# EasyEDA Pro project Echo EasyEDA professional project.epro, schematic Schematic1
Create Date: 2024-12-16; Page Name: P1; Project Name: Bynraky_pcb; Schematic Name: Schematic1; Update Date: 2025-02-06; Company: EasyEDA.com; Drawn: EasyEDA; Page Size: A4; Part Number: JLCPCB-002; Reviewed: EasyEDA; Version: V0.1
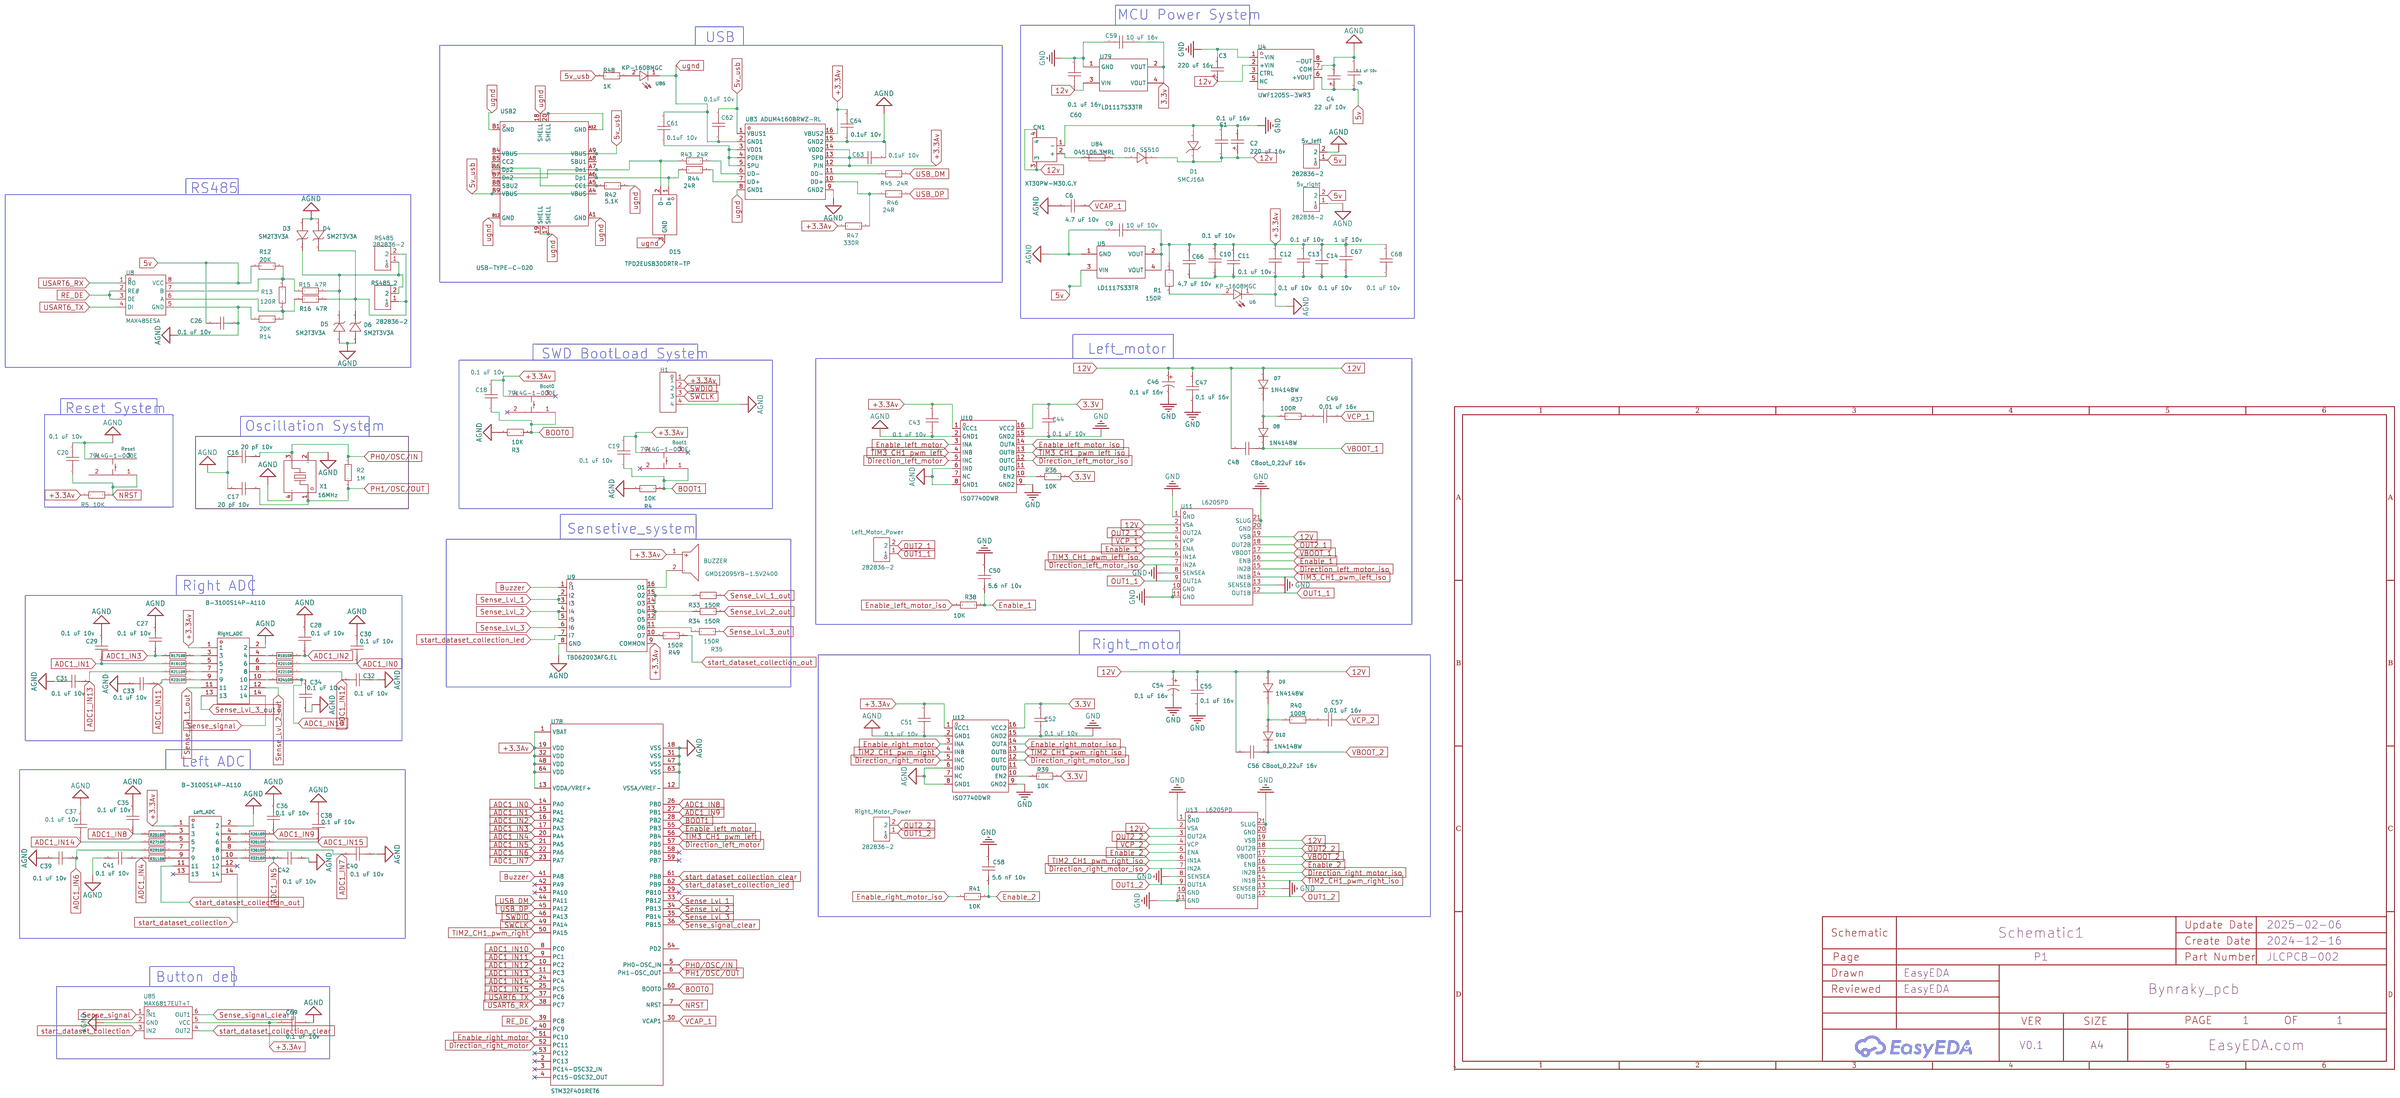
[diagram p0: schematic sheet]

## Parts
5v_left  282836-2  [CONN-TH_2P-P5.00_282836-2]
5v_right  282836-2  [CONN-TH_2P-P5.00_282836-2]
Boot0  7914G-1-000E  [KEY-SMD_4P-L5.0-W5.0-P2.54-LS5.5-BL]
Boot1  7914G-1-000E  [KEY-SMD_4P-L5.0-W5.0-P2.54-LS5.5-BL]
BUZZER  GMD12095YB-1.5V2400  [BUZ-TH_BD12.0-P7.60-D0.6-FD]
C1  0.1 uF 16v  [C0603]
C2  220 uF 16v  [CASE-E_7343]
C3  220 uF 16v  [CASE-E_7343]
C4  22 uF 10v  [CASE-B_3528]
C5  0.1 uF 10v  [C0603]
C6  4.7 uF 10v  [C0603]
C9  10 uF 10v  [C0603]
C10  0.1 uF 10v  [C0603]
C11  0.1 uF 10v  [C0603]
C12  0.1 uF 10v  [C0603]
C13  0.1 uF 10v  [C0603]
C14  0.1 uF 10v  [C0603]
C16  20 pF 10v  [C0603]
C17  20 pF 10v  [C0603]
C18  0.1 uF 10v  [C0603]
C19  0.1 uF 10v  [C0603]
C20  0.1 uF 10v  [C0603]
C26  0.1 uF 10v  [C0603]
C27  0.1 uF 10v  [C0603]
C28  0.1 uF 10v  [C0603]
C29  0.1 uF 10v  [C0603]
C30  0.1 uF 10v  [C0603]
C31  0.1 uF 10v  [C0603]
C32  0.1 uF 10v  [C0603]
C33  0.1 uF 10v  [C0603]
C34  0.1 uF 10v  [C0603]
C35  0.1 uF 10v  [C0603]
C36  0.1 uF 10v  [C0603]
C37  0.1 uF 10v  [C0603]
C38  0.1 uF 10v  [C0603]
C39  0.1 uF 10v  [C0603]
C40  0.1 uF 10v  [C0603]
C41  0.1 uF 10v  [C0603]
C42  0.1 uF 10v  [C0603]
C43  0.1 uF 10v  [C0603]
C44  0.1 uF 10v  [C0603]
C46  0,1 uF 16v  [CASE-A_3216]
C47  0,1 uF 16v  [C0603]
C48  CBoot_0,22uF 16v  [C0603]
C49  0,01 uF 16v  [C0603]
C50  5.6 nF 10v  [C0603]
C51  0.1 uF 10v  [C0603]
C52  0.1 uF 10v  [C0603]
C54  0,1 uF 16v  [CASE-A_3216]
C55  0,1 uF 16v  [C0603]
C56  CBoot_0,22uF 16v  [C0603]
C57  0,01 uF 16v  [C0603]
C58  5.6 nF 10v  [C0603]
C59  10 uF 16v  [C0603]
C60  0.1 uF 16v  [C0603]
C61  0.1uF 10v  [C0603]
C62  0.1uF 10v  [C0603]
C63  0.1uF 10v  [C0603]
C64  0.1uF 10v  [C0603]
C66  4.7 uF 10v  [C0603]
C67  1 uF 10v  [C0603]
C68  0.1 uF 10v  [C0603]
C69  0.1 uF 10v  [C0603]
CN1  XT30PW-M30.G.Y  [CONN-TH_XT30PW-M]
D1  SMCJ16A  [SMC_L6.9-W5.9-LS7.9-RD]
D3  SM2T3V3A  [DO-216AA_L1.9-W1.9-LS3.8-FD]
D4  SM2T3V3A  [DO-216AA_L1.9-W1.9-LS3.8-FD]
D5  SM2T3V3A  [DO-216AA_L1.9-W1.9-LS3.8-FD]
D6  SM2T3V3A  [DO-216AA_L1.9-W1.9-LS3.8-FD]
D7  1N4148W  [SOD-123FL_L2.7-W1.6-LS3.8-RD]
D8  1N4148W  [SOD-123FL_L2.7-W1.6-LS3.8-RD]
D9  1N4148W  [SOD-123FL_L2.7-W1.6-LS3.8-RD]
D10  1N4148W  [SOD-123FL_L2.7-W1.6-LS3.8-RD]
D15  TPD2EUSB30DRTR-TP  [SOT-723-3_L1.2-W0.8-LS1.20-BR]
D16  SS510  [SMA_L4.4-W2.8-LS5.4-RD]
H1  -  [HDR-TH_4P-P2.54-V-M]
Left_ADC  B-3100S14P-A110  [IDC-TH_310S-14P]
Left_Motor_Power  282836-2  [CONN-TH_2P-P5.00_282836-2]
R1  150R  [R0805]
R2  1M  [R0603]
R3  10K  [R0603]
R4  10K  [R0603]
R5  10K  [R0603]
R12  20K  [R0603]
R13  120R  [R1206]
R14  20K  [R0603]
R15  47R  [R0603]
R16  47R  [R0603]
R17  10R  [R0603]
R18  10R  [R0603]
R19  10R  [R0603]
R20  10R  [R0603]
R21  10R  [R0603]
R22  10R  [R0603]
R23  10R  [R0603]
R24  10R  [R0603]
R25  10R  [R0603]
R26  10R  [R0603]
R27  10R  [R0603]
R28  10R  [R0603]
R29  10R  [R0603]
R30  10R  [R0603]
R31  10R  [R0603]
R32  10R  [R0603]
R33  150R  [R0603]
R34  150R  [R0603]
R35  150R  [R0603]
R36  10K  [R0603]
R37  100R  [R0603]
R38  10K  [R0603]
R39  10K  [R0603]
R40  100R  [R0603]
R41  10K  [R0603]
R42  5,1K  [R0603]
R43  24R  [R0603]
R44  24R  [R0603]
R45  24R  [R0603]
R46  24R  [R0603]
R47  330R  [R0603]
R48  1K  [R0603]
R49  150R  [R0603]
Reset  7914G-1-000E  [KEY-SMD_4P-L5.0-W5.0-P2.54-LS5.5-BL]
Right_ADC  B-3100S14P-A110  [IDC-TH_310S-14P]
Right_Motor_Power  282836-2  [CONN-TH_2P-P5.00_282836-2]
RS485  282836-2  [CONN-TH_2P-P5.00_282836-2]
RS485_2  282836-2  [CONN-TH_2P-P5.00_282836-2]
U4  UWF1205S-3WR3  [PWRM-TH_UWFXXXXS-3WR3]
U5  LD1117S33TR  [SOT-223_L6.5-W3.5-P2.30-LS7.0-BR]
U6  KP-1608MGC  [LED0603-RD_GREEN]
U8  MAX485ESA  [SOIC-8_L4.9-W3.9-P1.27-LS6.0-BL]
U9  TBD62003AFG,EL  [SOP-16_L10.0-W4.4-P1.27-LS6.3-BL]
U10  ISO7740DWR  [SOIC-16_L10.3-W7.5-P1.27-LS10.3-BL]
U11  L6205PD  [POWERSO20_L15.9-W11.0-P1.27-LS14.2-BL-EP]
U12  ISO7740DWR  [SOIC-16_L10.3-W7.5-P1.27-LS10.3-BL]
U13  L6205PD  [POWERSO20_L15.9-W11.0-P1.27-LS14.2-BL-EP]
U78  STM32F401RET6  [LQFP-64_L10.0-W10.0-P0.50-LS12.0-BL]
U79  LD1117S33TR  [SOT-223_L6.5-W3.5-P2.30-LS7.0-BR]
U83  ADUM4160BRWZ-RL  [SOIC-16_L10.3-W7.5-P1.27-LS10.3-BL]
U84  045106.3MRL  [FUSE-SMD_L6.1-W2.6]
U85  MAX6817EUT+T  [SOT-23-6_L2.9-W1.6-P0.95-LS2.8-BL]
U86  KP-1608MGC  [LED0603-RD_GREEN]
USB2  USB-TYPE-C-020  [USB-SMD_USB-TYPE-C-020]
X1  16MHz  [CRYSTAL-SMD_4P-L5.0-W3.2-BL]

## Library data of the parts
5v_left 5v_right Left_Motor_Power Right_Motor_Power RS485 RS485_2 = 282836-2: Pitch:5mm Color:Green Mounting Style:Direct Insert Current Rating (Max):13.5A Voltage Rating (Max):300V Number of Pins:2P Number of Rows:1 Wire Gauge - AWG:16~30 Wire Gauge - AWG:16~30 Number of PINs Per Row:2; LCSC Part Name: 5mm 排数:1 每排P数:2 直插; Supplier Part: C590402; Manufacturer: TE Connectivity(泰科电子); Supplier Footprint: 插件,P=5mm; JLCPCB Part Class: Extended Part; Datasheet: https://atta.szlcsc.com/upload/public/pdf/source/20240119/1DE6D9456CCE01F1F664469E3029A1B4.pdf; Supplier: LCSC; Pitch: 5mm; Color: Green; Mounting Style: Direct Insert; Current Rating (Max): 13.5A; Voltage Rating (Max): 300V; Number of Pins: 2P; Number of Rows: 1; Wire Gauge - AWG: 16~30; Number of PINs Per Row: 2
Boot0 Boot1 Reset = 7914G-1-000E: Circuit:SPST-常开 Actuator Style:Round Button Operating Force:300gf Mounting Style:Brick nogging Contact Current:100mA Voltage Rating (DC):16V IP Rating:IP67 Pin Style:Gull Wing Operating Temperature:-55℃~+125℃ Operating Temperature:-55℃~+125℃; Supplier Part: C840653; Manufacturer: BOURNS; JLCPCB Part Class: Extended Part; Supplier: LCSC; Circuit: SPST-常开; Actuator Style: Round Button; Operating Force: 300gf; Mounting Style: Brick nogging; Contact Current: 100mA; Voltage Rating (DC): 16V; IP Rating: IP67; Pin Style: Gull Wing; Operating Temperature: -55℃~+125℃
BUZZER = GMD12095YB-1.5V2400: Supplier Part: C530406; Manufacturer: INGHAi(赢海); JLCPCB Part Class: Extended Part; Datasheet: https://atta.szlcsc.com/upload/public/pdf/source/20200702/C530406_E9C45F62392D9607487F1F351BFF23F3.pdf; Supplier: LCSC
C1 C5 C6 C9-C14 C16-C20 C26-C44 C47-C52 C55-C64 C66-C69 = CAP_0603: Supplier Footprint: 0603
C2 C3 = TAJE227K016RNJ: Capacitance: Tolerance:±10% Tolerance:±10% Rated Voltage: Equivalent Series Resistance(ESR):500mΩ@100kHz Operating Temperature:-55℃~+125℃ Operating Temperature:-55℃~+125℃; LCSC Part Name: 220uF ±10% 16V; Supplier Part: C7231; Manufacturer: Kyocera AVX; Supplier Footprint: CASE-E-7343; JLCPCB Part Class: Extended Part; Datasheet: https://atta.szlcsc.com/upload/public/pdf/source/20160107/1457707750344.pdf; Supplier: LCSC; Tolerance: ±10%; Equivalent Series Resistance(ESR): 500mΩ@100kHz; Operating Temperature: -55℃~+125℃
C4 = TAJB226K016RNJ: Capacitance: Tolerance:±10% Tolerance:±10% Rated Voltage: Equivalent Series Resistance(ESR):2.3Ω@100kHz Operating Temperature:-55℃~+125℃ Operating Temperature:-55℃~+125℃; LCSC Part Name: 22uF ±10% 16V; Supplier Part: C8020; Manufacturer: Kyocera AVX; Supplier Footprint: CASE-B-3528; JLCPCB Part Class: Extended Part; Datasheet: https://atta.szlcsc.com/upload/public/pdf/source/20160107/1457707750344.pdf; Supplier: LCSC; Tolerance: ±10%; Equivalent Series Resistance(ESR): 2.3Ω@100kHz; Operating Temperature: -55℃~+125℃
C46 C54 = CA45-A016K106T: Capacitance: Tolerance:±10% Tolerance:±10% Rated Voltage: Equivalent Series Resistance(ESR):3Ω@100kHz Operating Temperature:-55℃~+125℃ Operating Temperature:-55℃~+125℃; LCSC Part Name: 10uF ±10% 16V; Supplier Part: C119051; Manufacturer: 湘怡中元/湘江; Supplier Footprint: CASE-A-3216; JLCPCB Part Class: Extended Part; Datasheet: https://atta.szlcsc.com/upload/public/pdf/source/20191009/C435293_78A410F3D73489DBEAC46056C4262F7A.pdf; Supplier: LCSC; Tolerance: ±10%; Equivalent Series Resistance(ESR): 3Ω@100kHz; Operating Temperature: -55℃~+125℃
CN1 = XT30PW-M30.G.Y: Power:- Output:- Input:- Size:- Interface:- Type:- Colour:- MaximumCurrent:- Type:Aviation model plug RatedVoltage:DC 500V Type1:- NumberOfUSBHoles:- InterfaceType:Male head MetalMaterial:- InsulationMaterial:- RatedCurrent:15A RecommendedWireGauge:16/18/; LCSC Part Name: AMASS(艾迈斯)航模插头 卧式弯脚 XT30PW-M公头; Supplier Part: C431092; Manufacturer: AMASS(艾迈斯); JLCPCB Part Class: Extended Part; Datasheet: https://atta.szlcsc.com/upload/public/pdf/source/20220222/6A9F22F7850E25B33E1BE430ADF8560B.pdf; Supplier: LCSC; Type: Aviation model plug; RatedVoltage: DC 500V; InterfaceType: Male head; RatedCurrent: 15A; RecommendedWireGauge: 16/18/20AWG; contact resistance: 1.2mΩ; specifications: 2pin
D1 = SMCJ16A_C310019: Reverse Stand-Off Voltage (Vrwm):16V Maximum Clamping Voltage:26V Peak Pulse Current (Ipp)@10/1000us:57.7A Breakdown Voltage:17.8V Type:TVS; Supplier Part: C310019; Manufacturer: Brightking(君耀电子); Supplier Footprint: SMC(DO-214AB); JLCPCB Part Class: Extended Part; Datasheet: https://atta.szlcsc.com/upload/public/pdf/source/20181127/C310089_DF11A7ED4CCF9CC3586EB1D10F86E9D6.pdf; Supplier: LCSC; Reverse Stand-Off Voltage (Vrwm): 16V; Maximum Clamping Voltage: 26V; Peak Pulse Current (Ipp)@10/1000us: 57.7A; Breakdown Voltage: 17.8V; Type: TVS
D3-D6 = SM2T3V3A: Reverse Stand-Off Voltage (Vrwm):3.3V Maximum Clamping Voltage:6.8V Peak Pulse Current (Ipp)@10/1000us:25A Peak Pulse Power Dissipation (Ppp)@10/1000us:200W Breakdown Voltage:3.6V Reverse Leakage Current (Ir):500uA Type:TVS; LCSC Part Name: 单向TVS 3.3V截止 25A峰值脉冲; Supplier Part: C970557; Manufacturer: ST(意法半导体); Supplier Footprint: DO-216AA; JLCPCB Part Class: Extended Part; Datasheet: https://atta.szlcsc.com/upload/public/pdf/source/20201211/C970557_EBE10214B1FDEDE84815AE73A3ED0A7F.pdf; Supplier: LCSC; Reverse Stand-Off Voltage (Vrwm): 3.3V; Maximum Clamping Voltage: 6.8V; Peak Pulse Current (Ipp)@10/1000us: 25A; Peak Pulse Power Dissipation (Ppp)@10/1000us: 200W; Breakdown Voltage: 3.6V; Reverse Leakage Current (Ir): 500uA; Type: TVS
D7-D10 = 1N4148W_C143180: Diode Configuration: Forward Voltage (Vf@If):1.25V@150mA Reverse Voltage (Vr): Average Rectified Current (Io): Power Dissipation: Reverse Leakage Current:2.5uA@75V Reverse Recovery Time (trr): Operating Temperature:-55℃~+150℃@(Tj) Operating Temperature:-5; LCSC Part Name: 电压:75V 电流:150mA; Supplier Part: C143180; Manufacturer: FMS(美丽微); Supplier Footprint: SOD-123; JLCPCB Part Class: Extended Part; Datasheet: https://atta.szlcsc.com/upload/public/pdf/source/20171109/C143180_15102201600451103731.pdf; Supplier: LCSC; Forward Voltage (Vf@If): 1.25V@150mA; Reverse Leakage Current: 2.5uA@75V; Operating Temperature: -55℃~+150℃@(Tj)
D15 = TPD2EUSB30DRTR-TP: Supplier Part: C2844720; Manufacturer: TECH PUBLIC(台舟); Supplier Footprint: SOT-723-3; JLCPCB Part Class: Extended Part; Datasheet: https://atta.szlcsc.com/upload/public/pdf/source/20210910/0ECB21791D44DF637915A47DDFBF4563.pdf; Supplier: LCSC
D16 = SS510_C106905: Forward Voltage (Vf@If):850mV@5A Reverse Voltage (Vr):100V Average Rectified Current (Io):5A Reverse Leakage Current (Ir):50uA@100V; LCSC Part Name: 电压:100V 电流:5A; Supplier Part: C106905; Manufacturer: DIYI(迪一/芯诺); Supplier Footprint: SMA(DO-214AC); JLCPCB Part Class: Extended Part; Datasheet: https://atta.szlcsc.com/upload/public/pdf/source/20170413/1492062743215.pdf; Supplier: LCSC; Forward Voltage (Vf@If): 850mV@5A; Reverse Voltage (Vr): 100V; Average Rectified Current (Io): 5A; Reverse Leakage Current (Ir): 50uA@100V
H1 = HDR-M_2.54_1x4P: Supplier Footprint: Through
Left_ADC Right_ADC = B-3100S14P-A110: Connector Type:Horn buckle Pitch:2.54mm Structure:2x7P Holder Type:Straight Row Spacing:2.54mm Number of Rows:2 Pin Number in each Row:7 Contact Material:Brass Contact Plating:Gold; LCSC Part Name: 2.54mm 2x7P 排数:2 每排P数:7; Supplier Part: C146651; Manufacturer: Ckmtw(灿科盟); Supplier Footprint: 插件,P=2.54mm; JLCPCB Part Class: Extended Part; Datasheet: https://atta.szlcsc.com/upload/public/pdf/source/20171116/C146660_15108222388271123939.pdf; Supplier: LCSC; Connector Type: Horn buckle; Pitch: 2.54mm; Structure: 2x7P; Holder Type: Straight; Row Spacing: 2.54mm; Number of Rows: 2; Pin Number in each Row: 7; Contact Material: Brass; Contact Plating: Gold
R1 = ERJ6ENF2053V: Type:Thick Film Resistors Resistance:205kΩ Tolerance:±1% Tolerance:±1% Power(Watts): Overload Voltage (Max):- Temperature Coefficient:±100ppm/℃ Temperature Coefficient:±100ppm/℃ Operating Temperature Range:-55℃~+155℃ Operating Temperature Range:-55℃~+155℃; LCSC Part Name: 205kΩ ±1% 125mW 厚膜电阻; Supplier Part: C2077507; Manufacturer: PANASONIC(松下); Supplier Footprint: 0805; JLCPCB Part Class: Extended Part; Datasheet: https://atta.szlcsc.com/upload/public/pdf/source/20240116/DC5257A3024E44D37E518C2D5EB5F78B.pdf; Supplier: LCSC; Type: Thick Film Resistors; Tolerance: ±1%; Temperature Coefficient: ±100ppm/℃; Operating Temperature Range: -55℃~+155℃
R2-R5 R12 R14-R49 = Res_0603: Supplier Footprint: 0603
R13 = 1206W4J0121T5E: Type:Thick Film Resistors Resistance: Tolerance:±5% Tolerance:±5% Power(Watts): Overload Voltage (Max): Temperature Coefficient:±100ppm/℃ Temperature Coefficient:±100ppm/℃ Operating Temperature Range:-55℃~+155℃ Operating Temperature Range:-55℃~+155℃; LCSC Part Name: 120Ω ±5% 250mW 厚膜电阻; Supplier Part: C25351; Manufacturer: UNI-ROYAL(厚声); Supplier Footprint: 1206; JLCPCB Part Class: Extended Part; Datasheet: https://atta.szlcsc.com/upload/public/pdf/source/20200306/C422600_1E6D84923E4A46A82E41ADD87F860B5C.pdf; Supplier: LCSC; Type: Thick Film Resistors; Tolerance: ±5%; Temperature Coefficient: ±100ppm/℃; Operating Temperature Range: -55℃~+155℃
U4 = UWF1205S-3WR3_C41355411: TYPE:Boost type Number of channel:1 Power:6W input voltage (Vdc):4.5V~36V input voltage (Vdc):4.5V~36V Conversion Efficiency:78% Conversion Efficiency:78% Output Voltage:5V Output Voltage:5V Output Current (Max):600mA Output Current (Max):600mA Maximum Ca; LCSC Part Name: DCDC隔离电源模块; Supplier Part: C41355411; Manufacturer: YLPTEC(易川); Supplier Footprint: SIP,22x9.5mm; Datasheet: https://atta.szlcsc.com/upload/public/pdf/source/20240826/AEAF9B1AADA650674643EC738F202985.pdf; Supplier: LCSC; TYPE: Boost type; Number of channel: 1; Power: 6W; input voltage (Vdc): 4.5V~36V; Conversion Efficiency: 78%; Output Voltage: 5V; Output Current (Max): 600mA; Maximum Capacitive Load: 2200uF; Insulated Voltage: 3000V; Protective function: Short-Circuit  Protection; Operating Temperature range: -40℃~+85℃; Switching Frequency: 300kHz
U5 U79 = LD1117S33TR: Output Type:Fixed Maximum Input Voltage:15V Output Voltage:3.3V Output Voltage:3.3V Output Current:800mA Power Supply Rejection Ratio (PSRR):75dB@(120Hz) Dropout Voltage:1.2V@(800mA) standby current:10mA Feature:Thermal Protection(TSD)；Overcurrent Protect; LCSC Part Name: 可调与固定低压降正电压稳压器; Supplier Part: C86781; Manufacturer: ST(意法半导体); Supplier Footprint: SOT-223; JLCPCB Part Class: Extended Part; Datasheet: https://atta.szlcsc.com/upload/public/pdf/source/20181022/C283467_00098992BB1D287195B66486CE33A2DD.pdf; Supplier: LCSC; Output Type: Fixed; Maximum Input Voltage: 15V; Output Voltage: 3.3V; Output Current: 800mA; Power Supply Rejection Ratio (PSRR): 75dB@(120Hz); Dropout Voltage: 1.2V@(800mA); standby current: 10mA; Feature: Thermal Protection(TSD)；Overcurrent Protection(OCP); Operating Temperature: 0℃~+125℃; Output Polarity: Positive electrode; Number of Outputs: 1
U6 U86 = KP-1608MGC: Supplier Part: C598258; Manufacturer: Kingbright; Supplier Footprint: SMD; JLCPCB Part Class: Extended Part; Supplier: LCSC
U8 = MAX485ESA_C5279041: Supplier Part: C5279041; Manufacturer: TWGMC(台湾迪嘉); Supplier Footprint: SOP-8; JLCPCB Part Class: Extended Part; Datasheet: https://atta.szlcsc.com/upload/public/pdf/source/20221123/28407831C9A9BE6EF87858D2D3D1ED55.pdf; Supplier: LCSC
U9 = TBD62003AFG,EL: Number of Outputs:7 Output Current:500mA Input Voltage:50V Input Voltage:50V Operating Temperature -:-40℃~+85℃ Operating Temperature -:-40℃~+85℃; Supplier Part: C17553089; Manufacturer: TOSHIBA(东芝); Supplier Footprint: SOIC-16-175mil; JLCPCB Part Class: Extended Part; Datasheet: https://atta.szlcsc.com/upload/public/pdf/source/20180126/C165892_15169517250611308503.pdf; Supplier: LCSC; Number of Outputs: 7; Output Current: 500mA; Input Voltage: 50V; Operating Temperature	-: -40℃~+85℃
U10 U12 = ISO7740DWR: Applications:General-purpose Voltage Isolation or Not:不带电压隔离 Supply Voltage:2.25V~5.5V Supply Voltage:2.25V~5.5V Data Rate:100Mbps Number of Channels:4 Isolation voltage:5000Vrms Forward Channel:4 Reverse channel:0 Isolation Technology:电容隔离 Operating Temp; LCSC Part Name: 具有优异EMC性能的高速四通道增强型和基本型数字隔离器; Supplier Part: C529547; Manufacturer: TI(德州仪器); Supplier Footprint: SOIC-16-300mil; JLCPCB Part Class: Extended Part; Datasheet: https://www.ti.com/cn/lit/gpn/iso7742; Supplier: LCSC; Applications: General-purpose; Voltage Isolation or Not: 不带电压隔离; Supply Voltage: 2.25V~5.5V; Data Rate: 100Mbps; Number of Channels: 4; Isolation voltage: 5000Vrms; Forward Channel: 4; Reverse channel: 0; Isolation Technology: 电容隔离; Operating Temperature: -55℃~+125℃
U11 U13 = L6205PD: Supplier Part: C1523898; Manufacturer: ST(意法半导体); Supplier Footprint: PowerSO-20; JLCPCB Part Class: Extended Part; Datasheet: https://atta.szlcsc.com/upload/public/pdf/source/20201127/C962257_F77061A1191C4A10F81925AEC8B998BA.pdf; Supplier: LCSC
U78 = STM32F401RET6: CPU Core:ARM-M4 Program Storage Size:512KB GPIO Ports Number:50 Operating Voltage Range:1.7V~3.6V Operating Voltage Range:1.7V~3.6V CPU Maximum Speed:84MHz Operating Temperature Range:-40℃~+85℃ Operating Temperature Range:-40℃~+85℃ ADC (Bit):12bit Univers; LCSC Part Name: 带DSP和FPU的STM32动态效率ARM Cortex-M4 MCU，具有最大512 KB Flash、84 MHz CPU和ART加速器; Supplier Part: C116978; Manufacturer: ST(意法半导体); Supplier Footprint: LQFP-64(10x10); JLCPCB Part Class: Extended Part; Datasheet: https://atta.szlcsc.com/upload/public/pdf/source/20180130/C161736_15172973410651323369.pdf; Supplier: LCSC; CPU Core: ARM-M4; Program Storage Size: 512KB; GPIO Ports Number: 50; Operating Voltage Range: 1.7V~3.6V; CPU Maximum Speed: 84MHz; Operating Temperature Range: -40℃~+85℃; ADC (Bit): 12bit; Universal Serial Bus: Yes; Watchdog: Yes; Infrared Data Association: Yes; Low-Voltage Detect: Yes; Secure Digital Input and Output: Yes; Direct Memory Access: Yes; Internal Oscillator: Yes
U83 = ADUM4160BRWZ-RL_C57791: LCSC Part Name: 全速/低速5kVUSB数字隔离器; Supplier Part: C57791; Manufacturer: ADI(亚德诺); Supplier Footprint: SOIC-16-300mil; JLCPCB Part Class: Extended Part; Datasheet: https://atta.szlcsc.com/upload/public/pdf/source/20180327/C57791_1A1DC0BD2A9501538E79ECF10A1F69DF.pdf; Supplier: LCSC
U84 = 045106.3MRL: Type:SMD Fuse Current Rating:6.3A Voltage Rating  (AC):125V Voltage Rating (DC):125V Operating Temperature:-55℃~+125℃ Operating Temperature:-55℃~+125℃ Breaking Capacity:50A; LCSC Part Name: 125V贴片式保险丝; Supplier Part: C178982; Manufacturer: Littelfuse(美国力特); Supplier Footprint: SMD,6.1x2.7mm; JLCPCB Part Class: Extended Part; Datasheet: https://atta.szlcsc.com/upload/public/pdf/source/20180712/C206979_7E25512ECAE10E870376C2B87D611DA9.pdf; Supplier: LCSC; Type: SMD Fuse; Current Rating: 6.3A; Voltage Rating  (AC): 125V; Voltage Rating (DC): 125V; Operating Temperature: -55℃~+125℃; Breaking Capacity: 50A
U85 = MAX6817EUT+T: Supply Voltage:2.7V~5.5V Supply Voltage:2.7V~5.5V Operating Temperature:-40℃~+125℃ Operating Temperature:-40℃~+125℃; LCSC Part Name: ±15kV ESD保护，单/双/八路CMOS开关去抖器; Supplier Part: C516788; Manufacturer: ADI(亚德诺)/MAXIM(美信); Supplier Footprint: SOT-23-6; JLCPCB Part Class: Extended Part; Datasheet: https://atta.szlcsc.com/upload/public/pdf/source/20200421/C516788_E1E9E4AF5C7479B119A502969E1729E4.pdf; Supplier: LCSC; Supply Voltage: 2.7V~5.5V; Operating Temperature: -40℃~+125℃
USB2 = USB-TYPE-C-020: Connector Type:Type-C Standard:- Gender:Female Number of Ports:1 Number of Contacts:16P Mounting Style:卧贴 Current Rating - Power (Max):3A Operating Temperature Range:-25℃~+85℃ Operating Temperature Range:-25℃~+85℃; LCSC Part Name: Type-C 母 卧贴; Supplier Part: C2927040; Manufacturer: DEALON(德艺隆); Supplier Footprint: SMD; JLCPCB Part Class: Extended Part; Datasheet: https://atta.szlcsc.com/upload/public/pdf/source/20211217/7DCA1D6718C928159CC0455E6B85EBF0.pdf; Supplier: LCSC; Connector Type: Type-C; Gender: Female; Number of Ports: 1; Number of Contacts: 16P; Mounting Style: 卧贴; Current Rating - Power (Max): 3A; Operating Temperature Range: -25℃~+85℃
X1 = HY13MSMD50324POB1R10: Frequency: External load capacitor:20pF Frequency Stability(Full temperature range):±10ppm Frequency Stability(Full temperature range):±10ppm Equivalent Series Resistance (ESR):50Ω; LCSC Part Name: 13MHz 20pF; Supplier Part: C7275144; Manufacturer: Huiyuan crystal(惠源晶工); Supplier Footprint: SMD5032-4P; JLCPCB Part Class: Extended Part; Datasheet: https://atta.szlcsc.com/upload/public/pdf/source/20230530/D0430CADBE2CD60CA30268FC8461A922.pdf; Supplier: LCSC; External load capacitor: 20pF; Frequency Stability(Full temperature range): ±10ppm; Equivalent Series Resistance (ESR): 50Ω

## Nets
3.3V: C44.2 C52.2 R36.1 R39.1 U10.16(VCC2) U12.16(VCC2)
3.3v: C59.1 U79.2(VOUT) U79.4(VOUT)
5v: 5v_left.1 5v_right.2 C4.1 C5.1 C26.2 R12.1 U4.6(+VOUT) U5.3(VIN) U8.8(VCC)
5v_usb: C62.1 R48.1 U83.1(VBUS1) USB2.A4(VBUS) USB2.A9(VBUS) USB2.B4(VBUS) USB2.B9(VBUS)
12V: C46.1 C47.1 C48.2 C54.1 C55.1 C56.2 D7.2(A) D9.2(A) U11.2(VSA) U11.19(VSB) U13.2(VSA) U13.19(VSB)
12v: C1.1 C2.1 C3.1 C60.1 CN1.3 CN1.4 D1.1 D16.1(K) U4.2(+VIN) U79.3(VIN)
AGND: 5v_left.2 5v_right.1 C4.2 C5.2 C6.1 C9.2 C10.1 C11.1 C12.1 C13.1 C14.1 C16.2 C17.2 C20.2 C26.1 C27.2 C28.2 C29.2 C30.2 C31.2 C32.1 C33.2 C34.2 C35.2 C36.2 C37.2 C38.2 C39.2 C40.1 C41.2 C42.1 C43.1 C51.1 C63.2 C64.1 C66.2 C67.1 C68.1 C69.1 D3.1(A) D4.1(A) D5.1(A) D6.1(A) H1.4 Left_ADC.2 R3.1 R4.1 R14.1 Reset.4 Right_ADC.2 U4.7(COM) U5.1(GND) U6.1(C) U8.5(GND) U9.8(GND) U10.2(GND1) U10.6(IND) U10.8(GND1) U12.2(GND1) U12.6(IND) U12.8(GND1) U78.12(VSSA/VREF-) U78.18(VSS) U78.31(VSS) U78.47(VSS) U78.63(VSS) U83.9(GND2) U83.15(GND2) U85.2(GND) X1.2(GND) X1.4(GND)
GND: C1.2 C2.2 C3.2 C44.1 C46.2 C47.2 C50.2 C52.1 C54.2 C55.2 C58.2 C59.2 C60.2 CN1.1(-) D1.2 U4.1(-VIN) U10.9(GND2) U10.15(GND2) U11.1(GND) U11.8(SENSEA) U11.10(GND) U11.11(GND) U11.13(SENSEB) U11.20(GND) U11.21(SLUG) U12.9(GND2) U12.15(GND2) U13.1(GND) U13.8(SENSEA) U13.10(GND) U13.11(GND) U13.13(SENSEB) U13.20(GND) U13.21(SLUG) U79.1(GND)
+3.3Av: Boot0.4 Boot1.4 BUZZER.1 C9.1 C10.2 C11.2 C12.2 C13.2 C14.2 C18.2 C19.2 C43.2 C51.2 C63.1 C64.2 C66.1 C67.2 C68.2 C69.2 H1.1 Left_ADC.1 R1.1 R5.1 R47.1 Right_ADC.1 U5.2(VOUT) U5.4(VOUT) U9.9(COMMON) U10.1(VCC1) U12.1(VCC1) U78.1(VBAT) U78.13(VDDA/VREF+) U78.19(VDD) U78.32(VDD) U78.48(VDD) U78.64(VDD) U83.12(PIN) U83.13(SPD) U83.14(VDD2) U83.16(VBUS2) U85.5(VCC)
ADC1_IN0: C30.1 R20.2 U78.14(PA0)
ADC1_IN1: C29.1 R19.1 U78.15(PA1)
ADC1_IN2: C28.1 R18.2 U78.16(PA2)
ADC1_IN3: C27.1 R17.1 U78.17(PA3)
ADC1_IN4: C41.1 R31.1 U78.20(PA4)
ADC1_IN5: C42.2 R32.2 U78.21(PA5)
ADC1_IN6: C39.1 R29.1 U78.22(PA6)
ADC1_IN7: C40.2 R30.2 U78.23(PA7)
ADC1_IN8: C35.1 R25.1 U78.26(PB0)
ADC1_IN9: C36.1 R26.2 U78.27(PB1)
ADC1_IN10: C34.1 R24.2 U78.8(PC0)
ADC1_IN11: C33.1 R23.1 U78.9(PC1)
ADC1_IN12: C32.2 R22.2 U78.10(PC2)
ADC1_IN13: C31.1 R21.1 U78.11(PC3)
ADC1_IN14: C37.1 R27.1 U78.24(PC4)
ADC1_IN15: C38.1 R28.2 U78.25(PC5)
BOOT0: Boot0.1 C18.1 R3.2 U78.60(BOOT0)
BOOT1: Boot1.1 C19.1 R4.2 U78.28(PB2)
Buzzer: U9.1(I1) U78.41(PA8)
Direction_left_motor: U10.5(INC) U78.57(PB5)
Direction_left_motor_iso: U10.12(OUTC) U11.7(IN2A) U11.15(IN2B)
Direction_right_motor: U12.5(INC) U78.52(PC11)
Direction_right_motor_iso: U12.12(OUTC) U13.7(IN2A) U13.15(IN2B)
Enable_1: C50.1 R38.2 U11.5(ENA) U11.16(ENB)
Enable_2: C58.1 R41.2 U13.5(ENA) U13.16(ENB)
Enable_left_motor: U10.3(INA) U78.55(PB3)
Enable_left_motor_iso: R38.1 U10.14(OUTA)
Enable_right_motor: U12.3(INA) U78.51(PC10)
Enable_right_motor_iso: R41.1 U12.14(OUTA)
NRST: C20.1 R5.2 Reset.1 U78.7(NRST)
OUT1_1: Left_Motor_Power.1 U11.9(OUT1A) U11.12(OUT1B)
OUT1_2: Right_Motor_Power.1 U13.9(OUT1A) U13.12(OUT1B)
OUT2_1: Left_Motor_Power.2 U11.3(OUT2A) U11.18(OUT2B)
OUT2_2: Right_Motor_Power.2 U13.3(OUT2A) U13.18(OUT2B)
PH0/OSC/IN: C16.1 R2.1 U78.5(PH0-OSC_IN) X1.3
PH1/OSC/OUT: C17.1 R2.2 U78.6(PH1-OSC_OUT) X1.1
RE_DE: U8.2(RE#) U8.3(DE) U78.39(PC8)
Sense_Lvl_1: U9.2(I2) U9.3(I3) U78.33(PB12)
Sense_Lvl_1_out: R33.2 Right_ADC.11
Sense_Lvl_2: U9.4(I4) U9.5(I5) U78.34(PB13)
Sense_Lvl_2_out: R34.2 Right_ADC.12
Sense_Lvl_3: U9.6(I6) U78.35(PB14)
Sense_Lvl_3_out: R35.2 Right_ADC.13
Sense_signal: Right_ADC.14 U85.1(IN1)
Sense_signal_clear: U78.36(PB15) U85.6(OUT1)
start_dataset_collection: Left_ADC.14 U85.3(IN2)
start_dataset_collection_clear: U78.61(PB8) U85.4(OUT2)
start_dataset_collection_led: U9.7(I7) U78.62(PB9)
start_dataset_collection_out: Left_ADC.11 R49.2
SWCLK: H1.3 U78.49(PA14)
SWDIO: H1.2 U78.46(PA13)
TIM2_CH1_pwm_right: U12.4(INB) U78.50(PA15)
TIM2_CH1_pwm_right_iso: U12.13(OUTB) U13.6(IN1A) U13.14(IN1B)
TIM3_CH1_pwm_left: U10.4(INB) U78.56(PB4)
TIM3_CH1_pwm_left_iso: U10.13(OUTB) U11.6(IN1A) U11.14(IN1B)
ugnd: C61.2 C62.2 D15.3(GND) R42.2 U83.2(GND1) U83.8(GND1) U86.1(C) USB2.17(SHELL) USB2.18(SHELL) USB2.19(SHELL) USB2.20(SHELL) USB2.A1(GND) USB2.A12(GND) USB2.B1(GND) USB2.B12(GND)
USART6_RX: U8.1(RO) U78.38(PC7)
USART6_TX: U8.4(DI) U78.37(PC6)
USB_DM: R45.2 U78.44(PA11)
USB_DP: R46.2 U78.45(PA12)
VBOOT_1: C48.1 D8.1(K) U11.17(VBOOT)
VBOOT_2: C56.1 D10.1(K) U13.17(VBOOT)
VCAP_1: C6.2 U78.30(VCAP1)
VCP_1: C49.1 U11.4(VCP)
VCP_2: C57.1 U13.4(VCP)
$1N14481: R1.2 U6.2(A)
$1N50612: R34.1 U9.12(O5) U9.13(O4)
$1N52994: C49.2 R37.2
$1N52996: D7.1(K) D8.2(A) R37.1
$1N54500: C57.2 R40.2
$1N54502: D9.1(K) D10.2(A) R40.1
$1N66553: CN1.2(+) U84.1
$1N88741: R39.2 U12.10(EN2)
$1N90501: R36.2 U10.10(EN2)
$1N102361: R13.2 R14.2 R16.1 U8.6(A)
$1N102367: R12.2 R13.1 R15.1 U8.7(B)
$1N106732: Left_ADC.4 R26.1
$1N106734: Left_ADC.6 R28.1
$1N106736: Left_ADC.8 R30.1
$1N110429: Left_ADC.10 R32.1
$1N122577: R18.1 Right_ADC.4
$1N122580: R20.1 Right_ADC.6
$1N122586: R22.1 Right_ADC.8
$1N122589: R17.2 Right_ADC.3
$1N122592: R19.2 Right_ADC.5
$1N122595: R21.2 Right_ADC.7
$1N122604: R24.1 Right_ADC.10
$1N122607: R23.2 Right_ADC.9
$1N145821: R43.2 U83.6(UD-)
$1N145822: R44.2 U83.7(UD+)
$1N145824: R45.1 U83.11(DD-)
$1N145826: R46.1 R47.2 U83.10(DD+)
$1N145828: C61.1 U83.3(VDD1) U83.4(PDEN) U83.5(SPU)
$1N145834: R42.1 USB2.A5(CC1) USB2.B5(CC2)
$1N145837: D15.2(D-) R43.1 USB2.A7(Dn1) USB2.B7(Dn2)
$1N145838: D15.1(D+) R44.1 USB2.A6(Dp1) USB2.B6(Dp2)
$1N154907: Left_ADC.3 R25.2
$1N154909: Left_ADC.5 R27.2
$1N154911: Left_ADC.7 R29.2
$1N154913: Left_ADC.9 R31.2
$1N155259: R33.1 U9.14(O3) U9.15(O2)
$1N155266: BUZZER.2 U9.16(O1)
$1N162172: D4.2(K) D6.2(K) R16.2 RS485.2 RS485_2.1
$1N162185: D3.2(K) D5.2(K) R15.2 RS485.1 RS485_2.2
$1N162956: D16.2(A) U84.2
$1N163037: R35.1 U9.11(O6)
$1N163078: R49.1 U9.10(O7)
$1N182203: R48.2 U86.2(A)

Not connected (* = marked no-connect by the designer): Boot0 2* 3*; Boot1 2* 3*; Left_ADC 12* 13*; Reset 2 3; U4 3(CTRL) 5(NC) 8(-OUT); U10 7(NC) 11(OUTD); U12 7(NC) 11(OUTD); U78 2(PC13)* 3(PC14-OSC32_IN)* 4(PC15-OSC32_OUT)* 29(PB10)* 40(PC9)* 42(PA9)* 43(PA10)* 53(PC12)* 54(PD2) 58(PB6)* 59(PB7)*; USB2 A8(SBU1) B8(SBU2)

## Notes on the sheet
- MCU Power System
- USB
- RS485
- SWD BootLoad System
- Left_motor
- Reset System
- Oscillation System
- Sensetive_system
- Right ADC
- Right_motor
- Left ADC
- Button deb
